# Altium schematic sheet WireLessPhone_PhotoHall.SchDoc
size 420 x 297 mm; DocumentNumber: ФНКЦ.542321.001 Э3; SheetNumber: 4; Format: A3
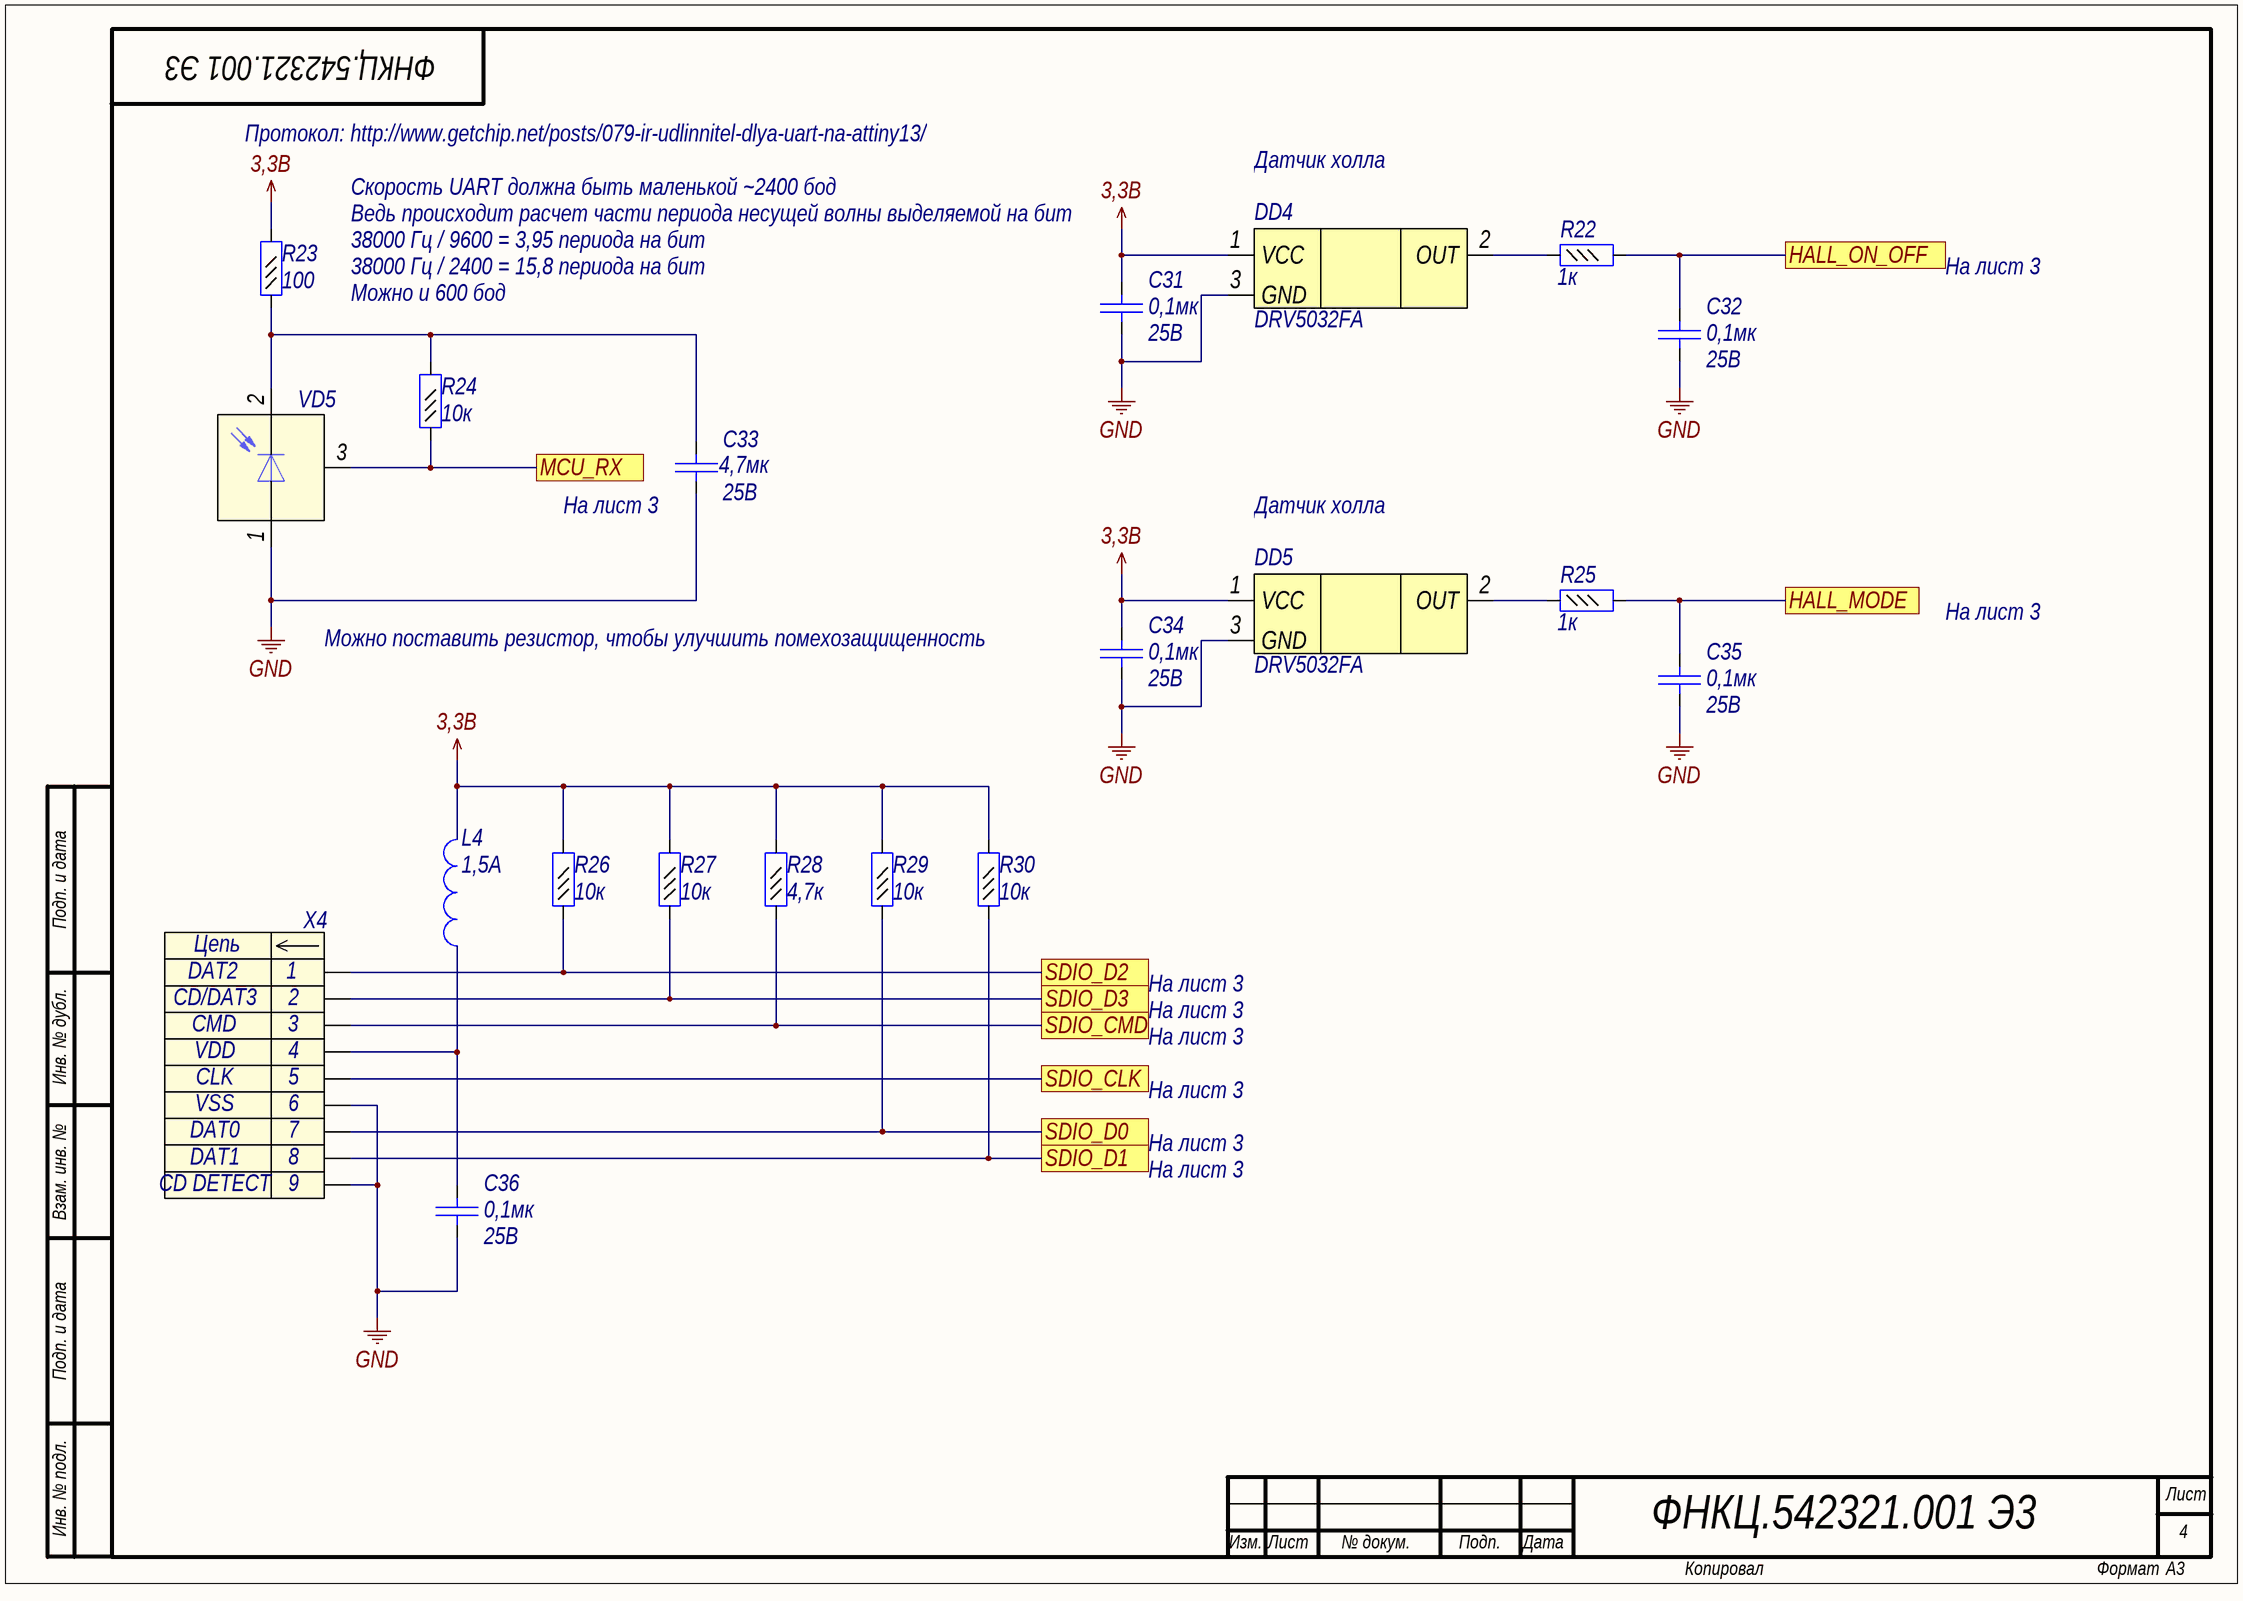
[diagram p0: WireLessPhone_PhotoHall.SchDoc]

## Parts
C31  value 0,1мк  Voltage: 25B  [C0402]  (hidden comment: Capacitor)
C32  value 0,1мк  Voltage: 25B  [C0402]  (hidden comment: Capacitor)
C33  value 4,7мк  Voltage: 25B  [C0805]  (hidden comment: Capacitor)
C34  value 0,1мк  Voltage: 25B  [C0402]  (hidden comment: Capacitor)
C35  value 0,1мк  Voltage: 25B  [C0402]  (hidden comment: Capacitor)
C36  value 0,1мк  Voltage: 25B  [C0402]  (hidden comment: Capacitor)
DD4  Part Number: DRV5032FA  [SOT23-3]  (hidden comment: DRV5032)
DD5  Part Number: DRV5032FA  [SOT23-3]  (hidden comment: DRV5032)
L4  Rated Current: 1,5A  [L0603]  (hidden comment: Inductor)
R22  value 1к  [R0402]  (hidden comment: Resistor_0,062Вт)
R23  value 100  [R0402]  (hidden comment: Resistor_0,062Вт)
R24  value 10к  [R0402]  (hidden comment: Resistor_0,062Вт)
R25  value 1к  [R0402]  (hidden comment: Resistor_0,062Вт)
R26  value 10к  [R0402]  (hidden comment: Resistor_0,062Вт)
R27  value 10к  [R0402]  (hidden comment: Resistor_0,062Вт)
R28  value 4,7к  [R0402]  (hidden comment: Resistor_0,062Вт)
R29  value 10к  [R0402]  (hidden comment: Resistor_0,062Вт)
R30  value 10к  [R0402]  (hidden comment: Resistor_0,062Вт)
VD5  IR_LED  [TVCAST]  (value not drawn)
X4  MICROSD-SDIO  [MICROSD]  (value not drawn)

## Ports
HALL_MODE, HALL_ON_OFF, MCU_RX, SDIO_CLK, SDIO_CMD, SDIO_D0, SDIO_D1, SDIO_D2, SDIO_D3

## Nets
3,3B: C31.1 C34.1 DD4.1(VCC) DD5.1(VCC) L4.2 R23.2 R26.2 R27.2 R28.2 R29.2 R30.2
GND: C31.2 C32.2 C33.1 C34.2 C35.2 C36.2 DD4.3(GND) DD5.3(GND) VD5.1(GND) X4.6 X4.9
HALL_MODE: C35.1 R25.2 ; port HALL_MODE
HALL_ON_OFF: C32.1 R22.2 ; port HALL_ON_OFF
MCU_RX: R24.1 VD5.3(OUT) ; port MCU_RX
SDIO_CLK: X4.5 ; port SDIO_CLK
SDIO_CMD: R28.1 X4.3 ; port SDIO_CMD
SDIO_D0: R29.1 X4.7 ; port SDIO_D0
SDIO_D1: R30.1 X4.8 ; port SDIO_D1
SDIO_D2: R26.1 X4.1 ; port SDIO_D2
SDIO_D3: R27.1 X4.2 ; port SDIO_D3
NetC33_2: C33.2 R23.1 R24.2 VD5.2(VCC)
NetC36_1: C36.1 L4.1 X4.4
NetDD4_2: DD4.2(OUT) R22.1
NetDD5_2: DD5.2(OUT) R25.1

## Notes on the sheet
- Протокол: http://www.getchip.net/posts/079-ir-udlinnitel-dlya-uart-na-attiny13/
- Датчик холла
- Скорость UART должна быть маленькой ~2400 бод
- Ведь происходит расчет части периода несущей волны выделяемой на бит
- 38000 Гц / 9600 = 3,95 периода на бит
- 38000 Гц / 2400 = 15,8 периода на бит
- Можно и 600 бод
- На лист 3
- (near C33) На лист 3
- Можно поставить резистор, чтобы улучшить помехозащищенность
- Подп. и дата
- Инв. № дубл.
- Взам. инв. №
- Инв. № подл.
- Лист
- Изм.
- № докум.
- Подп.
- Дата
- Копировал
- Формат
- (in symbol connect43) Цепь; CD DETECT

## Library data of the parts
C31 C32 C34-C36 = cap52: Конденсатор; Part Name: Ceramic; Manufacture: Murata; Part Number: GRM155F51E104Z**; id: cap52; TKE: Y5V
C33 = cap154: Конденсатор; Part Name: Ceramic; Manufacture: Murata; Part Number: GRM21BR61E475KA12L; id: cap154; TKE: X5R
DD4 DD5 = DRV5032FA: Датчик Холла с рекордно низким потреблением; Part Name: Hall sensor; Manufacture: Texas Instruments; id: hall1; Magnetic threshold: 4,8mT; MAGNETIC RESPONSE: Omnipolar; OUTPUT TYPE: Push-pull; SAMPLING RATE: 20 Hz; Power Supply: 1,65B...5,5B
L4 = ind0: EMI Suppression Filter; Part Name: EMI Suppression Filters; Part Number: BLM18PG181SN1D; id: ind0; Resistance: 0,09Ohm
R22 R25 = res266: Резистор; Manufacture: Yageo; Part Number: RC0402FR-071KL; id: res266; Accuracy: 1%; Part Name: Resistor; Power: 0,062Вт
R23 = res242: Резистор; Manufacture: Yageo; Part Number: RC0402FR-07100RL; id: res242; Accuracy: 1%; Part Name: Resistor; Power: 0,062Вт
R24 R26 R27 R29 R30 = res290: Резистор; Manufacture: Yageo; Part Number: RC0402FR-0710KL; id: res290; Accuracy: 1%; Part Name: Resistor; Power: 0,062Вт
R28 = res282: Резистор; Manufacture: Yageo; Part Number: RC0402FR-074K7; id: res282; Accuracy: 1%; Part Name: Resistor; Power: 0,062Вт
VD5 = diode26: Светодиод; Part Name: IR Receiver Modules; Part Number: TSOP39238; Manufacture: Vishay; Supply Voltage: 2,5-5,5B; Carrier Frequency: 38kHz; Transmission Distance: 30m; Viewing Angle: (+-)45; Detection Treshold: 0.08; id: diode26
X4 = connect43: Contact_1: DAT2; Contact_2: CD/DAT3; Contact_3: CMD; Contact_4: VDD; Contact_5: CLK; Contact_6: VSS; Contact_7: DAT0; Contact_8: DAT1; Part Name: MICRO SD-SDIO; id: connect43